# EAGLE design StampOfApprovalLEDCarrier (EAGLE 9.6.2)
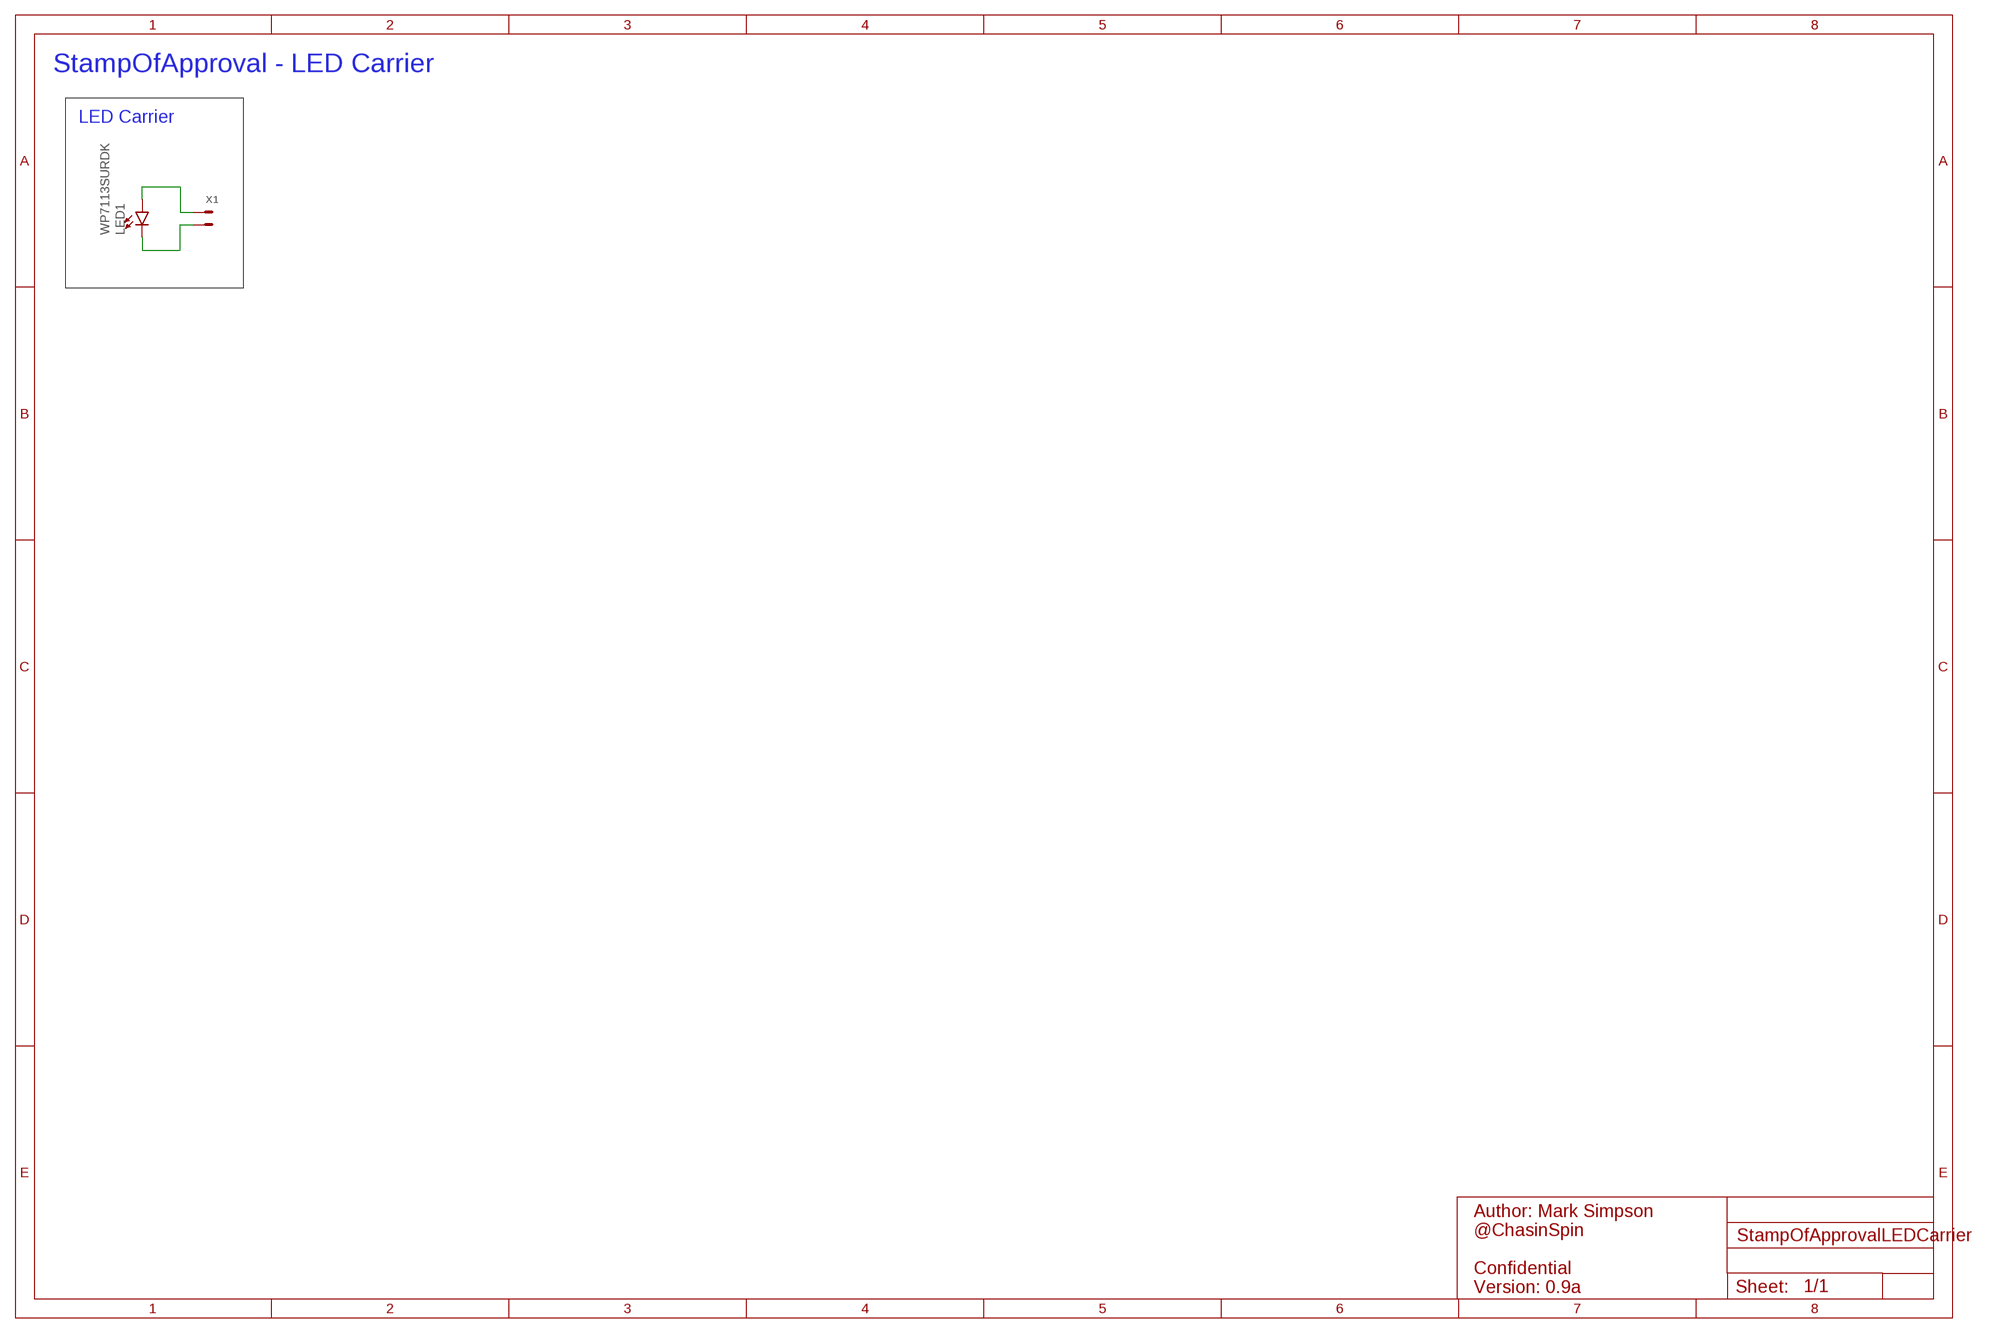
[diagram p0: schematic, sheet 1]

## Parts
LED1  WP7113SURDK  LED5MM  [LED_5MM]
X1  SOLDER_CONTACTS  [SOLDER_CONTACTS]

## Nets
N$1: LED1.A X1.1
N$2: LED1.K(C) X1.2

## Notes on the sheet
- StampOfApproval - LED Carrier
- LED Carrier
- Author: Mark Simpson
  @ChasinSpin
  
  Confidential
  Version: 0.9a

## Library data of the parts
LED1 = SkyFall:LED: LED (Generic) Standard schematic elements and footprints for 5mm, 3mm, 1206, and 0603 sized LEDs. Generic LEDs with no color specified.
X1 = SkyFall:SOLDER_CONTACTS

## Board
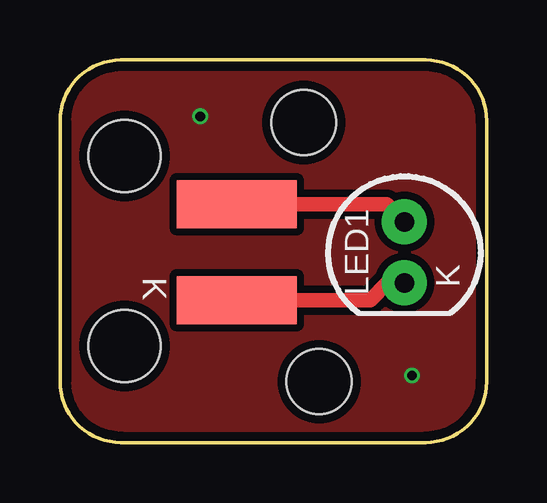
[diagram p1: board, top side]
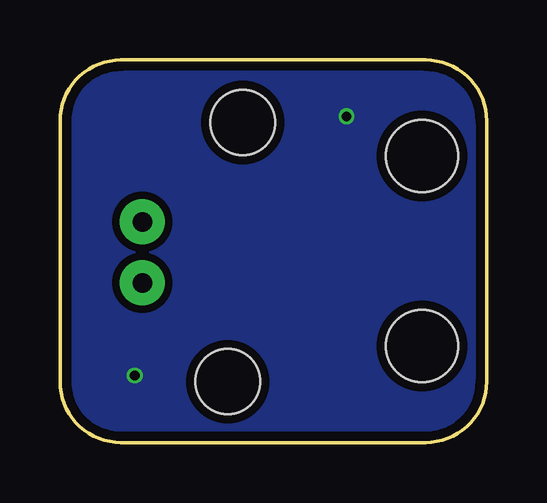
[diagram p2: board, bottom side, seen from below]

Size 17.78 x 15.94 mm. Coordinates in mm from the lower left corner, seen from the top.
Outline: 2.54,0 arc-90 0,2.54 0,13.4 arc-90 2.54,15.94 15.24,15.94 arc-90 17.78,13.4 17.78,2.54 arc-90 15.24,0 2.54,0
Copper layers (1*16): Top 0.035559375mm / dielectric 1.6mm / Bottom 0.035559375mm
Design rules "oshpark-2layer *": minimum track width 6mil, minimum drill 10mil, track to track 6mil, track to pad 6mil, pad to pad 6mil, via to via 6mil, smd to smd 6mil, copper to edge 15mil, drill to drill 6mil, minimum pad ring 5mil, minimum via ring 5mil, stop-mask expansion 2.5mil, vias tented up to drill 20mil, thermal gap 10mil
Holes 3 mm at 2.69,11.94 2.69,4.03
Holes 2.7 mm at 10.16,13.34 10.79,2.54

### Footprints (pad centres in the part's own frame; a part is rotated, then mirrored left to right if it is on the bottom)
LED_5MM = drill 0.813 pad 1.88: A -1.27,0; K 1.27,0
SOLDER_CONTACTS = smd 5 x 2: 1 0,2; 2 0,-2

### Placement (x,y rotation side)
LED1  14.35,7.92 270 top
X1  7.37,7.94 0 top

### Tracks (layer width: path | path; a pad name or v marks a point on that pad's centre or on a via)
0V  (via drill 0.41)
  other vias: 5.84,13.59 14.67,2.79
  pour Top (isolate 0.305, rank 2): 0,0 0,15.94 17.78,15.94 17.78,0
  pour Bottom (isolate 0.305, rank 2): 0,0 0,15.94 17.78,15.94 17.78,0
N$1
  Top 0.61: X1.1 13.61,9.94 LED1.A
N$2
  Top 0.61: X1.2 12.92,5.94 13.64,6.66 LED1.K

### Text on the board
tNames: K | K